# Altium schematic sheet MainBoard.SchDoc
size A4
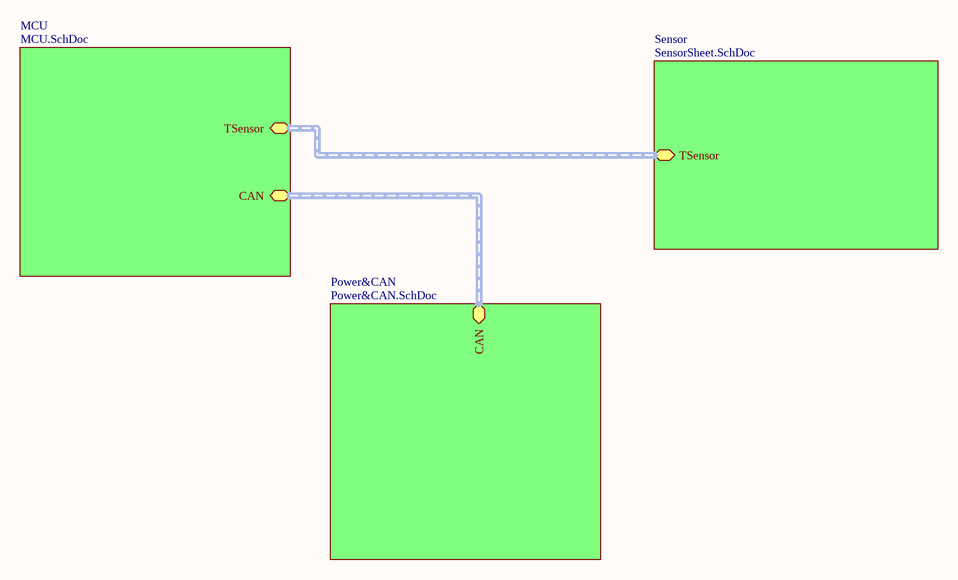
[diagram p0: MainBoard.SchDoc]

## Sub-sheets
MCU = MCU.SchDoc: TSensor (harness Sensor), CAN (harness CanHarness)
Power&CAN = Power&CAN.SchDoc: CAN (harness CanHarness)
Sensor = SensorSheet.SchDoc: TSensor (harness Sensor)

## Buses and harness runs
harness sheet MCU/CAN = sheet Power&CAN/CAN
harness sheet MCU/TSensor = sheet Sensor/TSensor